# Altium schematic sheet sdc_prech_top_sheet.SchDoc
size A4
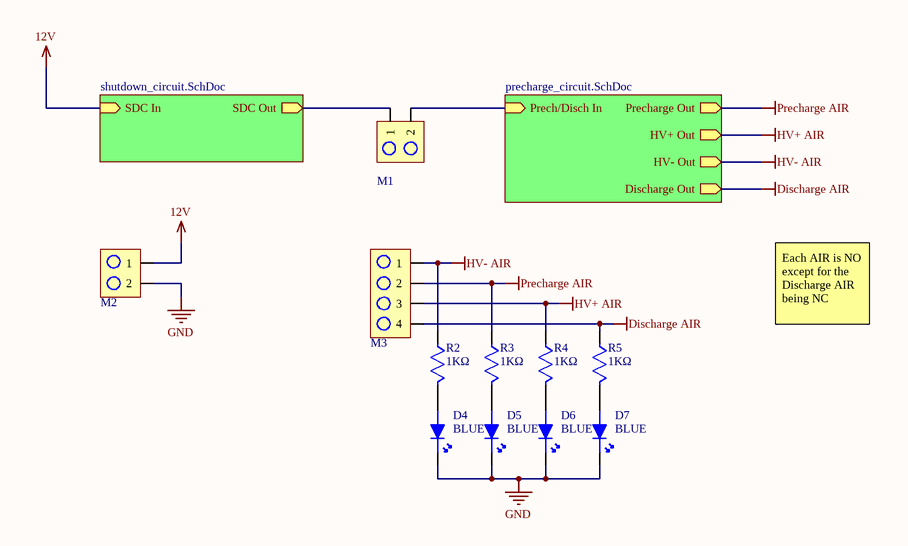
[diagram p0: sdc_prech_top_sheet.SchDoc]

## Parts
D4  BLUE  [LED 0603]
D5  BLUE  [LED 0603]
D6  BLUE  [LED 0603]
D7  BLUE  [LED 0603]
M1  0436500228  [2-PIN MOLEX]  (value not drawn)
M2  0436500228  [2-PIN MOLEX]  (value not drawn)
M3  0436500428  [4-PIN MOLEX]  (value not drawn)
R2  1KΩ  [RESISTOR CRCW0603]
R3  1KΩ  [RESISTOR CRCW0603]
R4  1KΩ  [RESISTOR CRCW0603]
R5  1KΩ  [RESISTOR CRCW0603]

## Sub-sheets
U_precharge_circuit = precharge_circuit.SchDoc: Prech/Disch In (in), Precharge Out (out), HV+ Out (out), HV- Out (out), Discharge Out (out)
U_shutdown_circuit = shutdown_circuit.SchDoc: SDC Out (out), SDC In (in)

## Nets
12V: M2.1 ; sheet U_shutdown_circuit/SDC In
Discharge AIR: M3.4 R5.1 ; sheet U_precharge_circuit/Discharge Out
GND: D4.2 D5.2 D6.2 D7.2 M2.2
HV+ AIR: M3.3 R4.1 ; sheet U_precharge_circuit/HV+ Out
HV- AIR: M3.1 R2.1 ; sheet U_precharge_circuit/HV- Out
Precharge AIR: M3.2 R3.1 ; sheet U_precharge_circuit/Precharge Out
NetD4_1: D4.1 R2.2
NetD5_1: D5.1 R3.2
NetD6_1: D6.1 R4.2
NetD7_1: D7.1 R5.2
NetM1_1: M1.1 ; sheet U_shutdown_circuit/SDC Out
NetM1_2: M1.2 ; sheet U_precharge_circuit/Prech/Disch In

## Notes on the sheet
- Each AIR is NO except for the Discharge AIR being NC

## Library data of the parts
D4-D7 = LTST-C191TBKT-5A: LED BLUE CLEAR CHIP SMD; Manufacturer: Vishay Lite-On; Lens Color: Colorless; Lens Style: Diffused,Colorless,Rectangular; Viewing Angle: 130°; Forward Current: 20mA; Forward Voltage: 2.8V; Luminous Intensity: 15mcd; Test Current: 5mA; Dominant Wavelength: 473nm; Number of LEDs: 1; Voltage: 29V; Supplier 1: Digi-Key; Manufacturer Part Number: LTST-C191TBKT-5A; Stock 1: 9654; Pricing 1: 1=0.5, 10=0.359, 100=0.1596, 500=0.11172, 1000=0.09177, 2500=0.0798 (USD); Mount: Surface Mount; Case/Package: 0603; Number of Pins: 2; Color: Blue; Case Code (Metric): 1608; Case Code (Imperial): 0603; Min Operating Temperature: -20°C; Max Operating Temperature: 80°C; Packaging: Tape and Reel; Package Quantity: 5000; Illumination Color: Blue; Lens Transparency: Clear; Length: 1.6mm; Height: 0.55mm; Width: 0.8mm; Radiation Hardening: No; ComponentLink1URL: http://optoelectronics.liteon.com/upload/download/DS22-2003-020/LTST-C191TBKT-5A.pdf?src-supplier=Digi-Key; ComponentLink1Description: http://optoelectronics.liteon.com/upload/download/DS22-2003-020/LTST-C191TBKT-5A.pdf?src-supplier=Digi-Key; ComponentLink2URL: http://components.arrow.com/part/dataview/52218576S9813001N1331?src-supplier=Arrow; ComponentLink2Description: http://components.arrow.com/part/dataview/52218576S9813001N1331?src-supplier=Arrow; ComponentLink3URL: http://optoelectronics.liteon.com/zh-cn/api/DwonloadFileHandler.ashx?txtSpecNo=DS22-2003-020&txtPartNo=LTST-C191TBKT-5A&src-supplier=Avnet; ComponentLink3Description: http://optoelectronics.liteon.com/zh-cn/api/DwonloadFileHandler.ashx?txtSpecNo=DS22-2003-020&txtPartNo=LTST-C191TBKT-5A&src-supplier=Avnet; ComponentLink4URL: http://www.mouser.com/ds/2/239/LTST-C191TBKT-5A-1150649.pdf?src-supplier=Mouser; ComponentLink4Description: http://www.mouser.com/ds/2/239/LTST-C191TBKT-5A-1150649.pdf?src-supplier=Mouser; Supplier Part Number 1: 160-2212-6-ND; Category: Optoelectronics
M1 M2 = 0436500228: Conn Power HDR 2 POS 3mm Solder ST Thru-Hole 2 Terminal 1 Port Micro-Fit 3.0™ Tray; Manufacturer: Molex; Number of Positions: 2; Connector Type: Male Pin; Number of Ports: 1; Supplier 1: Digi-Key; Manufacturer Part Number: 0436500228; Stock 1: 9247; Pricing 1: 1=0.9, 10=0.795, 100=0.6857, 500=0.56106, 1000=0.49872, 5000=0.43638, 10000=0.41456 (USD); Mount: Through Hole; Contact Plating: Gold; Housing Material: Polymer; Color: Black; Contact Material: Brass; Number of Terminals: 2; Min Operating Temperature: -40°C; Max Operating Temperature: 105°C; Number of Rows: 1; Packaging: Tray; Termination: Solder; Orientation: Straight; Package Quantity: 3264; Fastening Type: Ramp; Number of Contacts: 2; Length: 9.65mm; Pitch: 3mm; Depth: 5.57mm; ComponentLink1URL: http://www.molex.com/pdm_docs/sd/436500228_sd.pdf?src-supplier=Digi-Key; ComponentLink1Description: http://www.molex.com/pdm_docs/sd/436500228_sd.pdf?src-supplier=Digi-Key; ComponentLink2URL: http://components.arrow.com/part/dataview/2942358S8703676N3303?src-supplier=Arrow; ComponentLink2Description: http://components.arrow.com/part/dataview/2942358S8703676N3303?src-supplier=Arrow; Category: Connectors, Interconnects; Supplier Part Number 1: WM10658-ND
M3 = 0436500428: Conn Power HDR 4 POS 3mm Solder ST Thru-Hole 4 Terminal 1 Port Micro-Fit 3.0™ Tray; Manufacturer: Molex; Number of Positions: 4; Connector Type: Male Pin; Number of Ports: 1; Supplier 1: Digi-Key; Manufacturer Part Number: 0436500428; Stock 1: 1193; Pricing 1: 1=1.44, 10=1.265, 100=1.0916, 500=0.89316, 1000=0.79392, 5000=0.69468, 10000=0.65995 (USD); Mount: Through Hole; Contact Plating: Gold; Color: Black; Contact Material: Brass; Housing Material: Polymer; Number of Terminals: 4; Min Operating Temperature: -40°C; Max Operating Temperature: 105°C; Packaging: Tray; Number of Rows: 1; Termination: Solder; Fastening Type: Ramp; Number of Contacts: 4; Orientation: Straight; Package Quantity: 2040; Length: 15.65mm; Pitch: 3mm; Depth: 5.57mm; ComponentLink1URL: http://www.molex.com/pdm_docs/sd/436500428_sd.pdf?src-supplier=Digi-Key; ComponentLink1Description: http://www.molex.com/pdm_docs/sd/436500428_sd.pdf?src-supplier=Digi-Key; ComponentLink2URL: http://www.molex.com/webdocs/datasheets/pdf/en-us/0436500428_PCB_HEADERS.pdf?src-supplier=Avnet; ComponentLink2Description: http://www.molex.com/webdocs/datasheets/pdf/en-us/0436500428_PCB_HEADERS.pdf?src-supplier=Avnet; Supplier Part Number 1: WM10669-ND; Category: Connectors, Interconnects
R2-R5 = CRCW06031K00FKEA: RES SMD 1K OHM 1% 1/10W 0603; Manufacturer: Vishay Dale; Resistance: 1kR; Temperature Coefficient: 100ppm/°C; Power Rating: 100mW; Voltage Rating: 75V; Supplier 1: Digi-Key; Manufacturer Part Number: CRCW06031K00FKEA; Stock 1: 1811474; Pricing 1: 1=0.1, 10=0.034, 100=0.0139, 1000=0.00623, 2500=0.0054 (USD); Mount: Surface Mount; Case/Package: 0603; Number of Pins: 2; Weight: 7.1E-05oz; Contact Plating: Tin; Case Code (Metric): 1608; Case Code (Imperial): 0603; Min Operating Temperature: -55°C; Max Operating Temperature: 155°C; Composition: Thick Film; Tolerance: 1%; Termination: SMD/SMT; Packaging: Tape and Reel; Package Quantity: 10; Number of Terminations: 2; Military Standard: Not; Max Power Dissipation: 100mW; Voltage Rating (DC): 75V; Features: Automotive AEC-Q200; Length: 1.55mm; Height: 0.45mm; Width: 0.033inch; Depth: 0.85mm; Radiation Hardening: No; Lead Free: Lead Free; REACH SVHC: Unknown; ComponentLink1URL: http://www.vishay.com/docs/20035/dcrcwe3.pdf?src-supplier=Digi-Key; ComponentLink1Description: http://www.vishay.com/docs/20035/dcrcwe3.pdf?src-supplier=Digi-Key; ComponentLink2URL: http://uk.rs-online.com/webdocs/0d98/0900766b80d98afc.pdf?src-supplier=RSComponents; ComponentLink2Description: http://uk.rs-online.com/webdocs/0d98/0900766b80d98afc.pdf?src-supplier=RSComponents; ComponentLink3URL: http://www.vishay.com/docs/20035/dcrcwe3.pdf?src-supplier=Avnet; ComponentLink3Description: http://www.vishay.com/docs/20035/dcrcwe3.pdf?src-supplier=Avnet; ComponentLink4URL: http://www.vishay.com/docs/20035/dcrcwe3.pdf?src-supplier=Avnet+Asia; ComponentLink4Description: http://www.vishay.com/docs/20035/dcrcwe3.pdf?src-supplier=Avnet+Asia; ComponentLink5URL: http://www.farnell.com/datasheets/2310790.pdf?src-supplier=Element14; ComponentLink5Description: http://www.farnell.com/datasheets/2310790.pdf?src-supplier=Element14; ComponentLink6URL: https://www.distrelec.biz/Web/Downloads/a_/en/flD-CRCW-e3_data_en.pdf?mime=application%2Fpdf&src-supplier=Distrelec; ComponentLink6Description: https://www.distrelec.biz/Web/Downloads/a_/en/flD-CRCW-e3_data_en.pdf?mime=application%2Fpdf&src-supplier=Distrelec; ComponentLink7URL: http://www.vishay.com/docs/20035/dcrcwe3.pdf?src-supplier=Future+Electronics; ComponentLink7Description: http://www.vishay.com/docs/20035/dcrcwe3.pdf?src-supplier=Future+Electronics; ComponentLink8URL: http://www.vishay.com/docs/20035/dcrcwe3.pdf?src-supplier=Avnet+Europe; ComponentLink8Description: http://www.vishay.com/docs/20035/dcrcwe3.pdf?src-supplier=Avnet+Europe; Supplier Part Number 1: 541-1.00KHCT-ND; Category: Resistors